# Altium project Exp_INDRA.PrjPcb
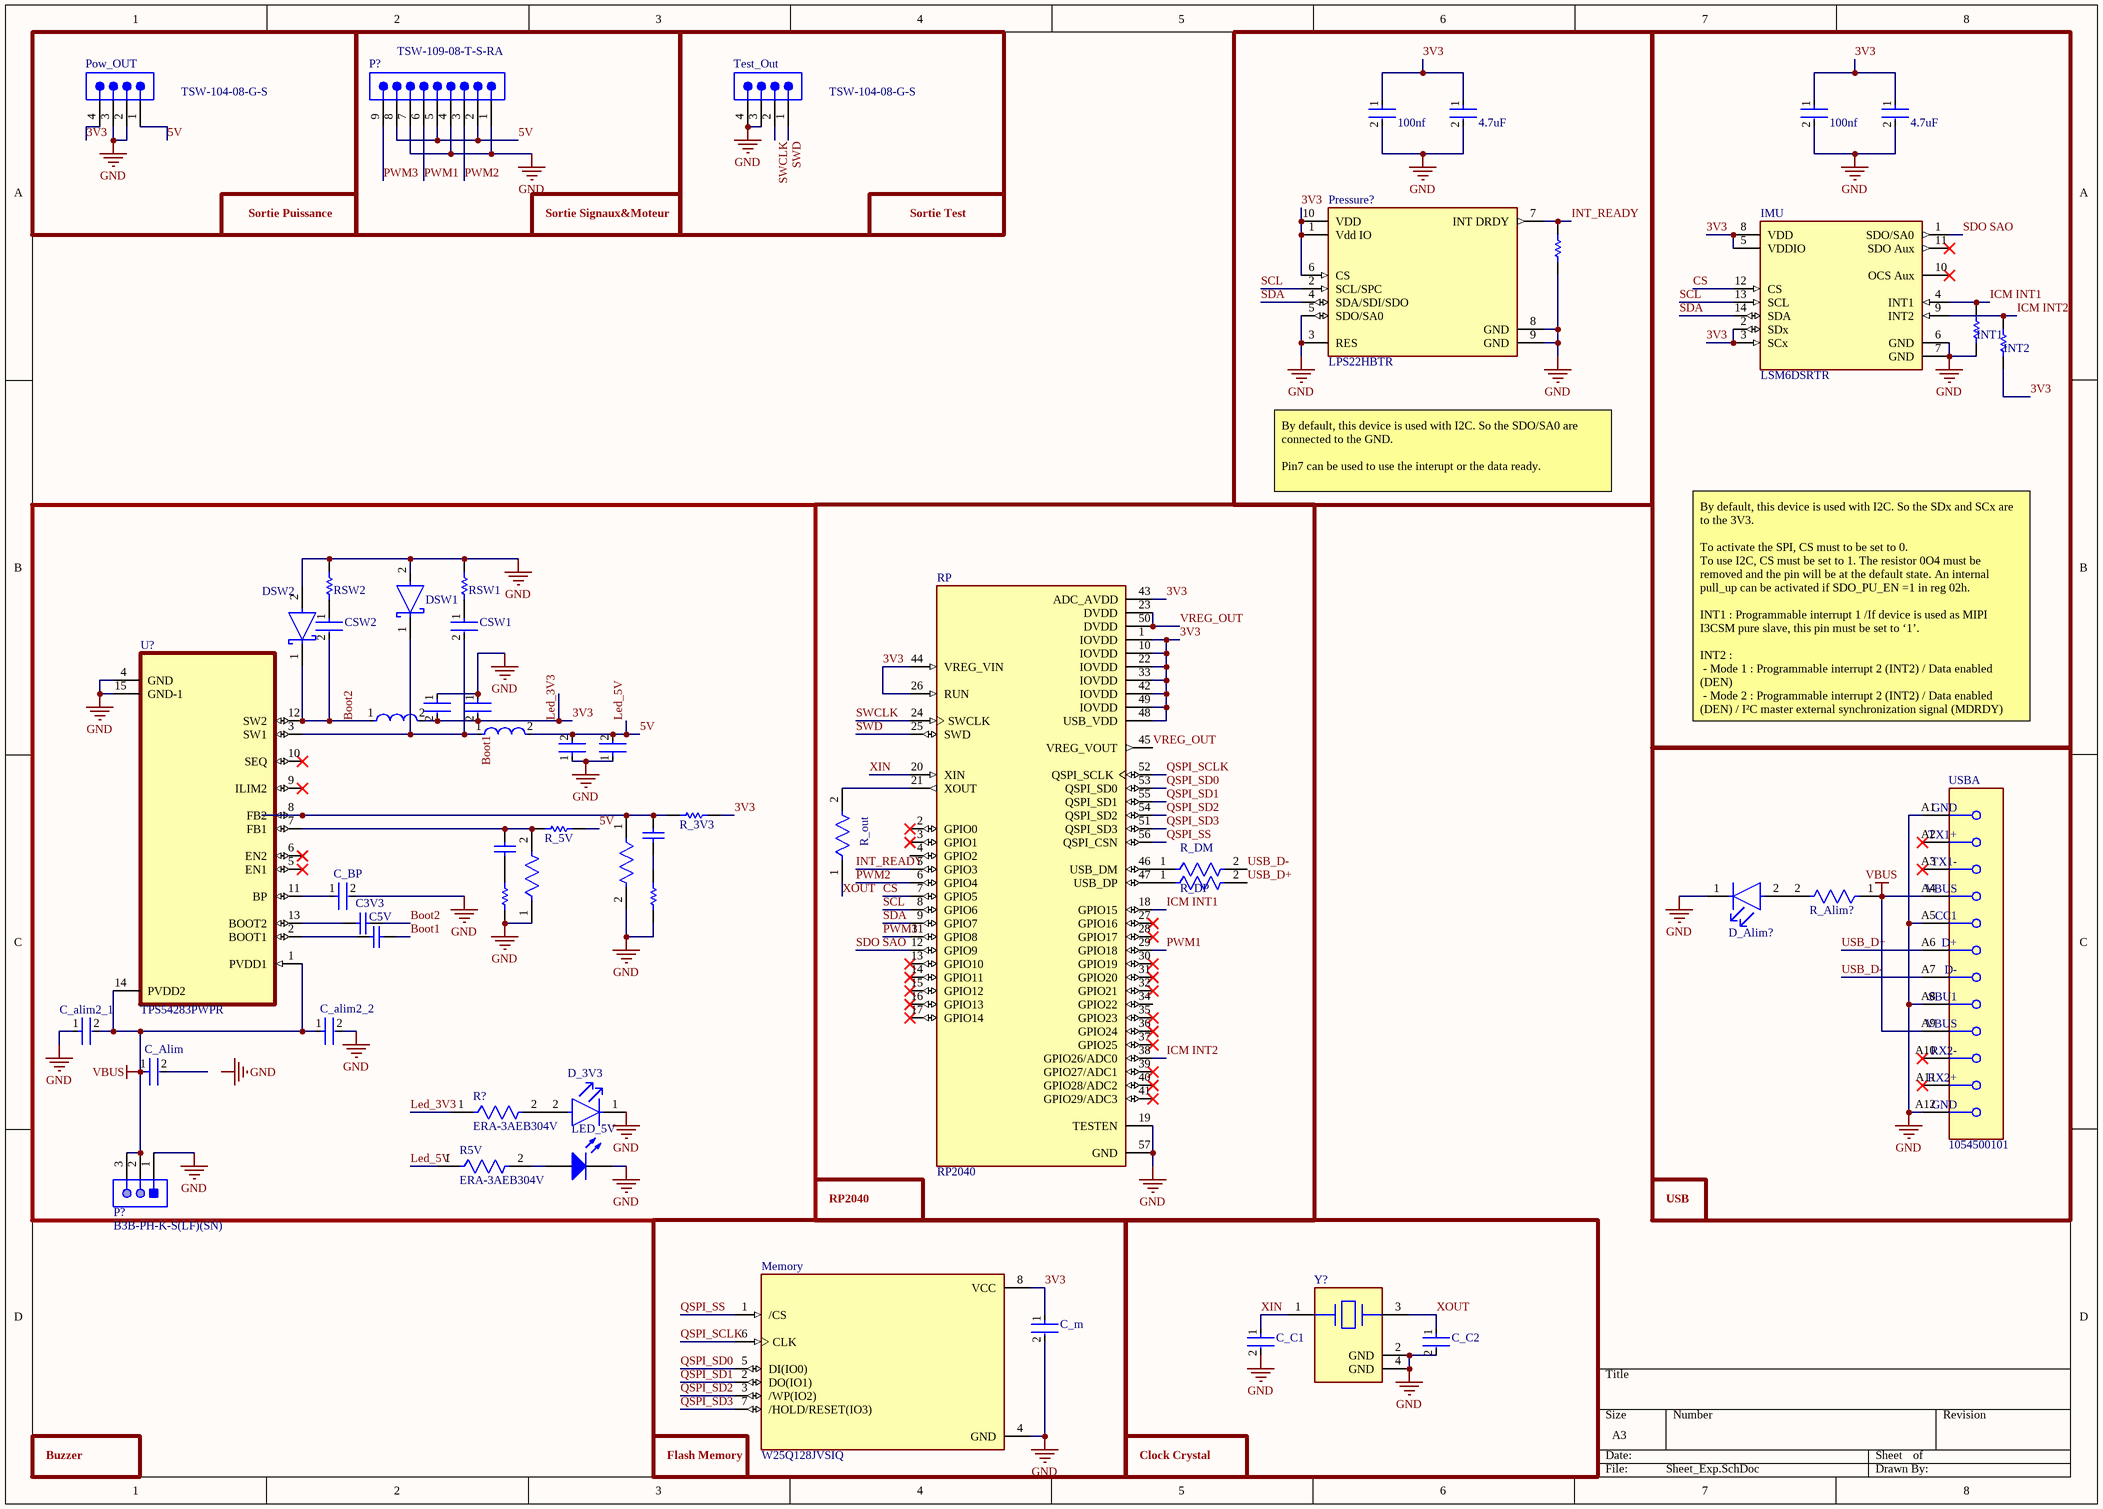
[diagram p0: Sheet_Exp.SchDoc]
1 sheet, 56 parts. Net scope: global (net labels, ports and power ports of the same name join across sheets).
Board file: PCB_Exp_INDRA.PcbDoc

## Sheet Sheet_Exp.SchDoc
size A3; SheetNumber: 1; SheetTotal: 1

### Parts
(Parts that share a designator on the sheet are numbered #1, #2 ... from top to bottom, then left to right.)
C3V3  GRM219R71H333KA01D  [CAPC2013X95X45NL10T25]  (value not drawn)
C5V  GRM219R71H333KA01D  [CAPC2013X95X45NL10T25]  (value not drawn)
C_3V31  GRM21BR61C106KE15L  [FP-GRM21B-0_1-IPC_C]  (value not drawn)
C_3V32  GRM21BR61C106KE15L  [FP-GRM21B-0_1-IPC_C]  (value not drawn)
C_5V1  GRM21BR61C106KE15L  [FP-GRM21B-0_1-IPC_C]  (value not drawn)
C_5V2  GRM21BR61C106KE15L  [FP-GRM21B-0_1-IPC_C]  (value not drawn)
C_Alim  GRM32ER60J107ME20L  [FP-GRM32-0_3-MFG]  (value not drawn)
C_alim2_1  GRM21BR61C106KE15L  [FP-GRM21B-0_1-IPC_C]  (value not drawn)
C_alim2_2  GRM21BR61C106KE15L  [FP-GRM21B-0_1-IPC_C]  (value not drawn)
C_BP  GRM155R60J475ME47D  [FP-GRM155-0_1-IPC_B]  (value not drawn)
C_C1  C0603C270J5GACTU  [FP-C0603C-CF-MFG]  (value not drawn)
C_C2  C0603C270J5GACTU  [FP-C0603C-CF-MFG]  (value not drawn)
C_m  CL10B104KB8NNND  [FP-CL10-IPC_A]  (value not drawn)
CFB2  GRM188R71H103KA01D  [CAPC1608X90X35ML10T15]  (value not drawn)
CFB?  GRM188R71H682KA01D  [CAPC1608X90X35LL10T15]  (value not drawn)
CIMU1  4.7uF  [FP-GRM188-0_2-IPC_C]
CIMU2  100nf  [FP-CGA3E-0_3-0_1-IPC_A]
CP1  4.7uF  [FP-GRM188-0_2-IPC_C]
CP2  100nf  [FP-CGA3E-0_3-0_1-IPC_A]
CSW1  C0603C471K5RACTU  [FP-C0603C-CF-MFG]  (value not drawn)
CSW2  C0603C471K5RACTU  [FP-C0603C-CF-MFG]  (value not drawn)
D_3V3  150060RS75000  [FP-150060RS75000-MFG]  (value not drawn)
D_Alim?  150060VS75000  [FP-150060VS75000-MFG]  (value not drawn)
DSW1  SK36B-TP  [FP-DO-214AA-MFG]  (value not drawn)
DSW2  SK36B-TP  [FP-DO-214AA-MFG]  (value not drawn)
IMU  LSM6DSRTR  [FP-LGA-14L-DM00249496-MFG]
INT1  ERJ3EKF1002V  [RESC1609X55X30LL15T15]  (value not drawn)
INT2  ERJ3EKF1002V  [RESC1609X55X30LL15T15]  (value not drawn)
L_3V3  LQH32CN220K23L  [FP-LQH32CH_23-MFG]  (value not drawn)
L_5V  LQH32CN220K23L  [FP-LQH32CH_23-MFG]  (value not drawn)
LED_5V  150060YS75000  [0603_A]  (value not drawn)
Memory  W25Q128JVSIQ  [SOIC127P790X216-8N]
P?#1  TSW-109-08-T-S-RA  [SMTC-TSW-109-08-X-S-RA]
P?#2  B3B-PH-K-S(LF)(SN)  [JST-B3B-PH-K-S-3_V]
Pow_OUT  TSW-104-08-G-S  [SMTC-TSW-104-08-X-S]
Pressure?  LPS22HBTR  [FP-HLGA-10L-8479831-0]
R1  ERJ-3EKF4701V  [RESC1608X55X30NL15T15]  (value not drawn)
R5V  ERA-3AEB304V  [FP-ERA3A-IPC_C]
R?  ERA-3AEB304V  [FP-ERA3A-IPC_C]
R_3V3  ERJ-3EKF2002V  [RESC1608X55X30ML15T15]  (value not drawn)
R_5V  ERJ-3EKF2002V  [RESC1608X55X30ML15T15]  (value not drawn)
R_Alim?  ERA-3AEB304V  [FP-ERA3A-IPC_C]  (value not drawn)
R_DM  ERJ-2RKF27R0X  [FP-ERJ2R-IPC_B]  (value not drawn)
R_DP  ERJ-2RKF27R0X  [FP-ERJ2R-IPC_B]  (value not drawn)
R_out  ERA-3AEB102V  [FP-ERA3A-IPC_C]  (value not drawn)
RFB2  CRCW06036K34FKEA  [FP-CRCW0603-e3-IPC_A]  (value not drawn)
RFB21  ERJ-3EKF4220V  [RESC1608X55X30LL15T15]  (value not drawn)
RFB22  CRCW06033K83FKEA  [FP-CRCW0603-e3-IPC_C]  (value not drawn)
RFB?  CRCW0603698RFKEA  [RESC1609X50X30NL10T20]  (value not drawn)
RP  RP2040  [QFN40P700X700X90-57N]
RSW1  ERJ3EKF1002V  [RESC1609X55X30LL15T15]  (value not drawn)
RSW2  ERJ3EKF1002V  [RESC1609X55X30LL15T15]  (value not drawn)
Test_Out  TSW-104-08-G-S  [SMTC-TSW-104-08-X-S]
U?  TPS54283PWPR  [IC_TPS27S100BPWPR]
USB  1054500101  [FP-1054500101-MFG]  (part A of 3)
Y?  ABM8G-12.000MHZ-18-D2Y-T  [FP-ABM8G-MFG]  (value not drawn)

### Blocks framed on the sheet
Sortie Puissance: Pow_OUT
Sortie Signaux&Moteur: P?#1
Sortie Test: Test_Out
RP2040: R_DM R_DP R_out RP
USB: D_Alim? R_Alim? USB
Clock Crystal: C_C1 C_C2 Y?

### Nets
GND: C_3V31.1 C_3V32.1 C_5V1.1 C_5V2.1 C_alim2_1.1 C_alim2_2.2 C_BP.2 C_C1.2 C_C2.2 C_m.2 CIMU1.2 CIMU2.2 CP1.2 CP2.2 D_3V3.1(C) D_Alim?.1(C) DSW1.2(A) DSW2.2(A) IMU.6(GND) IMU.7(GND) INT1.1 LED_5V.1(K) Memory.4(GND) P?#1.1 P?#1.4 P?#1.7 P?#2.1 Pow_OUT.2 Pow_OUT.3 Pressure?.3(RES) Pressure?.5(SDO/SA0) Pressure?.8(GND) Pressure?.9(GND) R1.1 RFB2.2 RFB21.1 RFB22.1 RFB?.2 RP.19(TESTEN) RP.57(GND) RSW1.1 RSW2.1 Test_Out.3 Test_Out.4 U?.4(GND) U?.15(GND-1) USB.A1(GND) USB.A5(CC1) USB.A8(SBU1) USB.A12(GND) Y?.2(GND) Y?.4(GND)
VBUS: C_Alim.1 C_alim2_1.2 C_alim2_2.1 P?#2.2 P?#2.3 R_Alim?.1 U?.1(PVDD1) U?.14(PVDD2) USB.A4(VBUS) USB.A9(VBUS)
3V3: C_3V31.2 C_3V32.2 C_m.1 CIMU1.1 CIMU2.1 CP1.1 CP2.1 IMU.2(SDx) IMU.3(SCx) IMU.5(VDDIO) IMU.8(VDD) INT2.1 L_3V3.2 Memory.8(VCC) Pow_OUT.4 Pressure?.1(Vdd_IO) Pressure?.6(CS) Pressure?.10(VDD) R?.1 R_3V3.1 RP.1(IOVDD) RP.10(IOVDD) RP.22(IOVDD) RP.26(RUN) RP.33(IOVDD) RP.42(IOVDD) RP.43(ADC_AVDD) RP.44(VREG_VIN) RP.48(USB_VDD) RP.49(IOVDD)  [also labelled Led_3V3]
5V: C_5V1.2 C_5V2.2 L_5V.2 P?#1.2 P?#1.5 P?#1.8 Pow_OUT.1 R5V.1 R_5V.2  [also labelled Led_5V]
Boot1: C5V.2 CSW1.2 DSW1.1(C) L_5V.1 U?.3(SW1)
Boot2: C3V3.2 CSW2.2 DSW2.1(C) L_3V3.1 U?.12(SW2)
CS: IMU.12(CS) RP.7(GPIO5)
ICM INT1: IMU.4(INT1) INT1.2 RP.18(GPIO15)
ICM INT2: IMU.9(INT2) INT2.2 RP.38(GPIO26/ADC0)
INT_READY: Pressure?.7(INT_DRDY) R1.2 RP.5(GPIO3)
PWM1: P?#1.6 RP.29(GPIO18)
PWM2: P?#1.3 RP.6(GPIO4)
PWM3: P?#1.9 RP.11(GPIO8)
QSPI_SCLK: Memory.6(CLK) RP.52(QSPI_SCLK)
QSPI_SD0: Memory.5(DI(IO0)) RP.53(QSPI_SD0)
QSPI_SD1: Memory.2(DO(IO1)) RP.55(QSPI_SD1)
QSPI_SD2: Memory.3(/WP(IO2)) RP.54(QSPI_SD2)
QSPI_SD3: Memory.7(/HOLD/RESET(IO3)) RP.51(QSPI_SD3)
QSPI_SS: Memory.1(/CS) RP.56(QSPI_CSN)
SCL: IMU.13(SCL) Pressure?.2(SCL/SPC) RP.8(GPIO6)
SDA: IMU.14(SDA) Pressure?.4(SDA/SDI/SDO) RP.9(GPIO7)
SDO SAO: IMU.1(SDO/SA0) RP.12(GPIO9)
SWCLK: RP.24(SWCLK) Test_Out.2
SWD: RP.25(SWD) Test_Out.1
USB_D+: R_DP.2 USB.A6(D+)
USB_D-: R_DM.2 USB.A7(D-)
VREG_OUT: RP.23(DVDD) RP.45(VREG_VOUT) RP.50(DVDD)
XIN: C_C1.1 RP.20(XIN) Y?.1
XOUT: C_C2.1 R_out.1 Y?.3
NetC3V3_1: C3V3.1 U?.13(BOOT2)
NetC5V_1: C5V.1 U?.2(BOOT1)
NetC_BP_1: C_BP.1 U?.11(BP)
NetCFB2_1: CFB2.1 R_5V.1 RFB22.2 U?.7(FB1)
NetCFB2_2: CFB2.2 RFB21.2
NetCFB?_1: CFB?.1 RFB?.1
NetCFB?_2: CFB?.2 R_3V3.2 RFB2.1 U?.8(FB2)
NetCSW1_1: CSW1.1 RSW1.2
NetCSW2_1: CSW2.1 RSW2.2
NetD_3V3_2: D_3V3.2(A) R?.2
NetD_Alim?_2: D_Alim?.2(A) R_Alim?.2
NetLED_5V_2: LED_5V.2(A) R5V.2
NetR_DM_1: R_DM.1 RP.46(USB_DM)
NetR_DP_1: R_DP.1 RP.47(USB_DP)
NetR_out_2: R_out.2 RP.21(XOUT)

Not connected (* = marked no-connect by the designer): C_Alim 2; IMU 10(OCS_Aux)* 11(SDO_Aux)*; RP 2(GPIO0)* 3(GPIO1)* 4(GPIO2) 13(GPIO10)* 14(GPIO11)* 15(GPIO12)* 16(GPIO13)* 17(GPIO14)* 27(GPIO16)* 28(GPIO17)* 30(GPIO19)* 31(GPIO20)* 32(GPIO21)* 34(GPIO22) 35(GPIO23)* 36(GPIO24)* 37(GPIO25)* 39(GPIO27/ADC1)* 40(GPIO28/ADC2)* 41(GPIO29/ADC3)*; U? 5(EN1)* 6(EN2)* 9(ILIM2)* 10(SEQ)*; USB A2(TX1+)* A3(TX1-)* A10(RX2-)* A11(RX2+)*

### Notes on the sheet
- By default, this device is used with I2C. So the SDO/SA0 are connected to the GND.
  Pin7 can be used to use the interupt or the data ready.
- By default, this device is used with I2C. So the SDx and SCx are to the 3V3.
  To activate the SPI, CS must to be set to 0.
  To use I2C, CS must be set to 1. The resistor 0O4 must be removed and the pin will be at the default state. An internal pull_up can be activated if SDO_PU_EN =1 in reg 02h.
  INT1 : Programmable interrupt 1 /If device is used as MIPI I3CSM pure slave, this pin must be set to ‘1’.
  INT2 :
  - Mode 1 : Programmable interrupt 2 (INT2) / Data enabled (DEN)
  - Mode 2 : Programmable interrupt 2 (INT2) / Data enabled (DEN) / I²C master external synchronization signal (MDRDY)
- Buzzer
- (near Memory) Flash Memory
- Labels drawn without touching a wire or pin: GND

### Library data of the parts
C3V3 C5V = CMP-1036-04169-2: Manufacturer: Murata; Part Number: GRM219R71H333KA01D
C_3V31 C_3V32 C_5V1 C_5V2 C_alim2_1 C_alim2_2 = CMP-2007-03453-2: Chip Multilayer Ceramic Capacitors for General Purpose, 0805, 10uF, X5R, 15%, 10%, 16V; Radiation Hardening: No; Thickness: 0.053inch; Voltage Rating (DC): 16V; Lead Free: Lead Free; Package Quantity: 1; Width: 1.25mm; Case Code (Imperial): 0805; Depth: 1.25mm; Packaging: Tape and Reel; Dielectric: X5R; Max Operating Temperature: 85°C; Tolerance: 10%; Voltage Rating: 16V; Voltage: 16V; Capacitance: 10uF; Height: 1.25mm; Case Code (Metric): 2012; Material: Ceramic; Mount: Surface Mount; Case/Package: 0805; REACH SVHC: No SVHC; Length: 2mm; Min Operating Temperature: -55°C; Termination: SMD/SMT
C_Alim = CMP-2000-05259-2: CAP CER 100UF 6.3V X5R 1210; 3DS Part Number: 220-00002; Manufacturer: Murata; Temperature Coefficient: 15%; Tolerance: 20%; Octopart: https://octopart.com/grm32er60j107me20l-murata-197007; ComponentLink2URL: https://search.murata.co.jp/Ceramy/image/img/A01X/G101/ENG/GRM32ER60J107ME20-01.pdf; Temperature Range High: +85°C; RoHS: TRUE; Device Class L3: Ceramic Capacitors; Manufacturer Part Number: GRM32ER60J107ME20L; Device Class L2: Capacitors; Voltage: 6.3V; Package: GRM32-0.3; Voltage Rating: 6.3V; Category: Cap; Device Class L1: Passive Components; Temperature Characteristic: X5R; Automotive: No; Digikey Description: CAP CER 100UF 6.3V X5R 1210; Temperature: -55°C to +85°C; Height: 2.7mm; Ipc Land Pattern Name: CAPC320250X250; Capacitance: 100uF; Material: Ceramic; Temperature Range Low: -55°C; Lead Free: Yes; Value: 100uF; ComponentLink2Description: Datasheet
C_BP = CMP-2008-04549-2: Chip Multilayer Ceramic Capacitors for General Purpose, 0402, 4.7uF, X5R, 15%, 20%, 6.3V; Height: 0.5mm; Weight: 0.000212oz; Length: 1mm; Case Code (Metric): 1005; Packaging: Tape and Reel; Termination: SMD/SMT; Dielectric: X5R; Depth: 0.5mm; Case Code (Imperial): 0402; Min Operating Temperature: -55°C; Case/Package: 0402; Voltage: 6.3V; Width: 0.02inch; Capacitance: 4.7uF; Lead Free: Lead Free; Thickness: 0.022inch; Contact Plating: Tin; REACH SVHC: No SVHC; Package Quantity: 10000; Tolerance: 20%; Voltage Rating (DC): 6.3V; Voltage Rating: 6.3V; Mount: Surface Mount; Max Operating Temperature: 85°C
C_C1 C_C2 = CMP-2006-03314-2: CAP CER 27PF 50V C0G/NP0 0603; Manufacturer: KEMET; Tolerance: 0.05; Automotive Grade: Grade 1; Temperature Characteristic: C0G; Temperature Coefficient: 30ppm/°C; RoHS: TRUE; Lead Free: Yes; Automotive: Yes; Material: Ceramic; Category: Cap; Digikey Description: CAP CER 27PF 50V C0G/NP0 0603; Device Class L3: Ceramic Capacitors; Capacitance: 27 pF; Temperature Range High: +125°C; Octopart: https://octopart.com/c0603c270j5gactu-kemet-136059; Value: 27 pF; Temperature Range Low: -55°C; ComponentLink2URL: https://api.kemet.com/component-edge/download/datasheet/C0603C100J5GACAUTO.pdf; Device Class L2: Capacitors; Mouser Description: Multilayer Ceramic Capacitors MLCC - SMD/SMT 50volts 27pF C0G 5%; Device Class L1: Passive Components; ComponentLink2Description: Datasheet; Voltage Rating: 50 V; Package: C0603C-CF; Height: 0.87mm; Temperature: -55°C to +125°C; Manufacturer Part Number: C0603C270J5GACTU
C_m = CMP-13271-000587-1: Cap Ceramic 100nF 50V X7R ±10% Pad SMD 0603 +125°C T/R; Case/Package: 0603; Depth: 0.8mm; Max Operating Temperature: 125°C; Lead Free: Lead Free; Material: Ceramic; Voltage Rating: 50V; Min Operating Temperature: -55°C; Voltage Rating (DC): 50V; Dielectric: X7R; Height: 0.8mm; Capacitance: 100nF; Thickness: 0.035inch; Radiation Hardening: No; Voltage: 50V; Packaging: Tape and Reel; Length: 1.6mm; Tolerance: 10%; Width: 0.031inch; Mount: Surface Mount; Package Quantity: 10000
CFB2 = CMP-2100-03642-1: Chip Capacitor, 10 nF, +/- 10%, 50 V, -55 to 125 degC, 0603 (1608 Metric), RoHS, Tape and Reel; Manufacturer: Murata; Insulation Resistance: 10GR; Dielectric: X7R; Voltage Rating: 50V; Capacitance: 10nF; Dielectric Material: Ceramic; Package Quantity: 1; Lead Free: LeadFree; Case/Package: 0603; Termination: SMD/SMT; REACH SVHC: Unknown; Manufacturer URL: http://www.murata.com/; Datasheet URL: http://search.murata.co.jp/Ceramy/image/img/A01X/G101/ENG/GRM188R71H103KA01-01.pdf; Mount: SurfaceMount; Datasheet Version: 42401.0; Number of Pins: 2; Length: 1.6mm; Voltage: 50V; Depth: 0.8mm; Tolerance: 10%; Min Operating Temperature: -55degC; Voltage Rating (DC): 50V; Max Operating Temperature: 125degC; Package Description: 2-Pin Surface Mount Device, Body 1.6 x 0.8 mm; RoHSCompliant: True; Case Code (Imperial): 0603; Width: 0.031inch; Case Code (Metric): 1608; Height: 0.8mm; Package Reference: 0603; Packaging: TapeandReel; Thickness: 0.035inch; Material: Ceramic
CFB? = CMP-2006-02934-1: Manufacturer: Murata; Part Number: GRM188R71H682KA01D
CIMU1 CP1 = CMP-2006-02545-2: Chip Multilayer Ceramic Capacitors for General Purpose, 0603, 4.7uF, X5R, 15%, 10%, 35V GRM188R6YA475KE15D; Lead Free: Lead Free; Max Operating Temperature: 85°C; Case Code (Imperial): 0603; Capacitance: 4.7uF; Width: 0.8mm; Thickness: 0.031inch; Case Code (Metric): 1608; Min Operating Temperature: -55°C; Voltage Rating (DC): 35V; Dielectric: X5R; Voltage: 35V; Packaging: Tape and Reel; Resistor Type: Ceramic; Weight: 0.000222oz; Mount: Surface Mount; Material: Ceramic; Depth: 0.8mm; Tolerance: 10%; REACH SVHC: No SVHC; Case/Package: 0603; Voltage Rating: 35V; Package Quantity: 4000; Height: 0.8mm; Length: 1.6mm; Termination: SMD/SMT
CIMU2 CP2 = CMP-2000-07546-2: Cap Ceramic 100nF 50V X7R 10% Pad SMD 0603 +125°C Automotive T/R CGA3E2X7R1H104K080AA; Weight: 7.1E-05oz; Composition: Ceramic; Max Operating Temperature: 125°C; Termination: SMD/SMT; Dielectric: X7R; Length: 1.6mm; Package Quantity: 1; REACH SVHC: No SVHC; Lead Free: Lead Free; Case Code (Metric): 1608; Min Operating Temperature: -55°C; Packaging: Tape and Reel; Tolerance: 10%; Voltage Rating: 50V; Case Code (Imperial): 0603; Capacitance: 100nF; Case/Package: 0603; Voltage Rating (DC): 50V; Depth: 0.8mm; Radiation Hardening: No; Ratings: AEC-Q200; Mount: Surface Mount; Voltage: 50V; Thickness: 0.035inch; Width: 0.8mm; Height: 0.8mm
CSW1 CSW2 = CMP-2006-03816-2: CAP CER 470PF 50V X7R 0603; Manufacturer: KEMET; Tolerance: 0.1; Temperature Coefficient: 30ppm/°C; Automotive Grade: Grade 1; Capacitance: 470 pF; Manufacturer Part Number: C0603C471K5RACTU; Temperature Characteristic: X7R; Mouser Description: Ceramic Capacitor, 470Pf, 50V, X7R, 10%, 0603, Full Reel; Material: Ceramic; Height: 0.87mm; Temperature: -55°C to +125°C; RoHS: TRUE; Lead Free: Yes; Category: Cap; ComponentLink2URL: https://api.kemet.com/component-edge/download/datasheet/C0603C100J5GACAUTO.pdf; Device Class L3: Ceramic Capacitors; Temperature Range High: +125°C; Package: C0603C-CF; Automotive: Yes; Device Class L2: Capacitors; Device Class L1: Passive Components; Value: 470 pF; Digikey Description: CAP CER 470PF 50V X7R 0603; Temperature Range Low: -55°C; ComponentLink2Description: Datasheet; Voltage Rating: 50 V; Octopart: https://octopart.com/c0603c471k5ractu-kemet-89311
D_3V3 = CMP-1426-00001-2: LED RED CLEAR 0603 SMD; Luminous Intensity: 250mcd; Viewing Angle: 140°; Dominant Wavelength: 625nm; Test Current: 20mA; Forward Current: 30mA; Forward Voltage: 2V; Lens Color: Colorless; Lens Size: 0.7mm; Width: 0.8mm; Series: WL-SMCW; Color: Red; Min Operating Temperature: -40°C; RoHS Compliant: Yes; Height: 0.8mm; Package Quantity: 1; Packaging: Cut Tape; Mount: Surface Mount; Case/Package: 0603; Lens Transparency: Clear; Length: 1.6mm; Case Code (Imperial): 0603; Lens Style: Clear; Wavelength: 625nm; Max Operating Temperature: 85°C; Case Code (Metric): 1608
D_Alim? = CMP-1426-00006-5: LED GREEN CLEAR 0603 SMD; Viewing Angle: 140°; Reverse Voltage (DC): 5V; Forward Voltage: 2V; Power Rating: 72mW; Lens Size: 0.7mm; Test Current: 20mA; Lens Color: Colorless; Lens Style: Rectangular; Luminous Intensity: 40mcd; Wavelength: 570nm; Length: 1.6mm; Max Operating Temperature: 85°C; Lens Transparency: Clear; Width: 0.8mm; Mount: Surface Mount; Weight: 0.000882oz; Package Quantity: 4000; Packaging: Cut Tape; RoHS Compliant: Yes; Case/Package: 0603; Series: WL-SMCW; Case Code (Metric): 1608; Illumination Color: Green; Color: Green; Case Code (Imperial): 0603; Forward Current: 20mA; Min Operating Temperature: -40°C; Height: 0.8mm; Dominant Wavelength: 570nm; Number of Pins: 2
DSW1 DSW2 = CMP-56206-000011-1: DIODE SCHOTTKY 60V 3A DO214AA; Max Surge Current: 100A; Capacitance: 45pF; Max Reverse Current: 20mA; Forward Voltage: 750mV; Max Reverse Leakage Current: 500uA; Polarity: Standard; Element Configuration: Single; Max Repetitive Reverse Voltage (Vrrm): 60V; Current Rating: 3A; Length: 4.57mm; Radiation Hardening: No; Package Quantity: 1; Forward Current: 3A; Voltage Rating (DC): 60V; Case/Package: DO-214AA; Min Operating Temperature: -55°C; Number of Pins: 2; Mount: Surface Mount; Max Forward Surge Current (Ifsm): 100A; RoHS Compliant: Yes; Packaging: Tape and Reel; Max Reverse Voltage (DC): 60V; Max Operating Temperature: 125°C; Width: 3.94mm; Height: 2.44mm; Peak Non-Repetitive Surge Current: 100A; Output Current: 3A; Lead Free: Lead Free; Average Rectified Current: 3A
IMU = CMP-12177-000003-1: INEMO INERTIAL MODULE: 3D ACCELE; Manufacturer: STMicroelectronics; Sensor Output: I2C,SPI; Accel Range: 2/4/8/16g; Gyro Range: 125/250/500/1000/2000/4000°/s; Operating Supply Current: 360-1200uA; Max Supply Voltage: 3.6V; Min Supply Voltage: 1.62V; Sensor Type: Temperature,Accelerometer,Gyroscope; Device Class L3: Inertial Measurement Units (IMUs); Package: LGA-14L-DM00249496; ComponentLink2Description: Datasheet; Mouser Description: In a Pack of 2, LSM6DSRTR STMicroelectronics, 3-Axis Accelerometer, Gyroscope, 14-Pin LGA; Footprint Url: https://www.st.com/content/ccc/resource/technical/document/technical_note/73/17/9c/16/dd/96/4a/01/CD00134799.pdf/files/CD00134799.pdf/jcr:content/translations/en.CD00134799.pdf; RoHS: TRUE; Automotive: No; Temperature Range High: +85°C; Digikey Description: INEMO INERTIAL MODULE: 3D ACCELE; Manufacturer Part Number: LSM6DSRTR; ComponentLink2URL: https://www.st.com/resource/en/datasheet/lsm6dsr.pdf; Lead Free: Yes; Category: IC; Temperature Range Low: -40°C; Height: 0.86mm; Octopart: https://octopart.com/lsm6dsrtr-stmicroelectronics-93180177; Temperature: -40°C to +85°C; Device Class L1: Sensors; Device Class L2: Motion Sensors
INT1 INT2 RSW1 RSW2 = CMP-1012-00623-3: Chip Resistor, 10 KOhm, +/- 1%, 0.1 W, -55 to 155 degC, 0603 (1608 Metric), RoHS, Tape and Reel; Manufacturer: Panasonic; Voltage Rating: 75V; Case\/Package: 0603; Power Rating: 100mW; Resistance: 10KOhm; Temperature Coefficient: 100ppm\/degreesC; Number of Pins: 2; Package Reference: 603; Depth: 0.8mm; Mount: SurfaceMount; Package Description: 2-Pin Surface Mount Device, Body 1.6 x 0.85 mm; Datasheet Version: 02/2017; Length: 1.6mm; Lead Free: LeadFree; Height: 0.45mm; Number of Terminations: 2; Max Power Dissipation: 100mW; Min Operating Temperature: -55degC; Datasheet URL: https://industrial.panasonic.com/cdbs/www-data/pdf/RDA0000/AOA0000C304.pdf; Termination: SMD/SMT; Case Code (Metric): 1608; Case Code (Imperial): 0603; Tolerance: 1%; Max Operating Temperature: 155degC; RoHSCompliant: true; Voltage Rating (DC): 75V; Radiation Hardening: No; Packaging: TapeandReel; Composition: ThickFilm; Mounting Technology: SurfaceMount; Manufacturer URL: http://www.panasonic.com/; Width: 0.031inch; REACH SVHC: NoSVHC; Contact Plating: Tin; Military Standard: Not; Package Quantity: 1
L_3V3 L_5V = CMP-06042-007714-2: Wire Wound Ferrite Inductor for Power Lines 22μH ±10% 0.923Ω 250mA 1210; Self Resonant Frequency: 19MHz; Test Frequency: 1MHz; DC Resistance (DCR): 710mR; Inductance: 22uH; Current: 80mA; Shielding: Unshielded; Rated Current-Max: 250mA; Tolerance: 10%; Case Code (Metric): 3225; Max DC Current: 250mA; Length: 3.2mm; Core Material: Ferrite; Max Operating Temperature: 85°C; RoHS Compliant: Yes; Radiation Hardening: No; Min Operating Temperature: -40°C; Lead Free: Lead Free; Weight: 0.002116oz; Termination: SMD/SMT; Width: 2.5mm; Military Standard: Not; Depth: 2.7mm; Frequency: 19MHz; Height: 2mm; Package Quantity: 2000; Case/Package: 1210; Current Rating: 250mA; Case Code (Imperial): 1210; Packaging: Tape and Reel; DC Current: 250mA; Series: LQH32C_23; Mount: Surface Mount
LED_5V = CMP-1426-00005-1: SMD mono-color Chip LED, WL-SMCW, Yellow; Manufacturer: Wuerth Elektronik; ComponentLink1URL: http://www.we-online.com; PartNumber: 150060YS75000; Color: Yellow; ComponentLink2Description: Datasheet; ComponentLink2URL: http://katalog.we-online.com/led/datasheet/150060YS75000.pdf; ComponentLink1Description: Manufacturer URL; PackageReference: 0603_A
Memory = W25Q128JVSIQ: FLASH - NOR Memory IC 128Mb (16M x 8) SPI - Quad I/O, QPI, DTR 133 MHz 8-SOIC; MF: Winbond Electronics; Price: None; Purchase-URL: https://pricing.snapeda.com/search/part/W25Q128JVSIQ/?ref=eda; Check_prices: https://www.snapeda.com/parts/W25Q128JVSIQ/Winbond+Electronics/view-part/?ref=eda; Value: *; MP: W25Q128JVSIQ; Package: SOIC-8 Winbond; SnapEDA_Link: https://www.snapeda.com/parts/W25Q128JVSIQ/Winbond+Electronics/view-part/?ref=snap; Availability: In Stock
P?#1 = CMP-1024-00420-1: 0.025" SQ Post Header, Through-hole, Right Angle, -55 to 105 degC, 2.54 mm Pitch, 9-Pin, Male, RoHS; Manufacturer: Samtec; Pitch: 2.54 mm; Mounting Technology: Through-hole; ComponentLink3URL: http://www.samtec.com/documents/webfiles/cpdf/TSW-XXX-XX-XXX-X-XX-XXX-MKT.pdf; ComponentLink1URL: http://www.samtec.com; PackageDescription: .025[0.64] SQ. Post Terminal Strip Assembly; ComponentLink2Description: Datasheet; PartNumber: TSW-109-08-T-S-RA; DatasheetVersion: F-214; Temperature Range: -55 to 105 degC; ComponentLink3Description: Package Specification; PackageReference: TSW-109-08-X-S-RA; PackageVersion: DM, 8/1988; ComponentLink2URL: http://www.samtec.com/documents/webfiles/pdf/TSW_TH.PDF; RoHS: True; Orientation: Right Angle; ComponentLink1Description: Manufacturer URL
P?#2 = CMP-2000-05164-1: Male Header, Pitch 2 mm, 1 x 3 Position, Height 6 mm, Tail Length 3.4 mm, -25 to 85 degC, RoHS, Bulk; Manufacturer: JST; Style/Orientation: StraightHeader/Plug; Pitch: 2mm; No of Positions: 3; Termination: Crimp; Manufacturer URL: http://www.jst.com/home2.html; Datasheet Version: Oct-06; Type: ShroudedHeader; Datasheet URL: https://datasheet.ciiva.com/11746/0900766b80826550-11746939.pdf
Pow_OUT Test_Out = CMP-1024-00357-1: 0.025" SQ Post Header, Through-hole, Vertical, -55 to 125 degC, 2.54 mm Pitch, 4-Pin, Male, RoHS; Manufacturer: Samtec; Pitch: 2.54 mm; RoHS: True; ComponentLink3URL: http://www.samtec.com/documents/webfiles/cpdf/TSW-XXX-XX-XXX-X-XX-XXX-MKT.pdf; Mounting Technology: Through-hole; ComponentLink2URL: http://www.samtec.com/documents/webfiles/pdf/TSW_TH.PDF; ComponentLink1URL: http://www.samtec.com; ComponentLink3Description: Package Specification; PackageVersion: DM, 8/1988; ComponentLink2Description: Datasheet; PackageReference: TSW-104-08-X-S; PackageDescription: .025[0.64] SQ. Post Terminal Strip Assembly; PartNumber: TSW-104-08-G-S; ComponentLink1Description: Manufacturer URL; Temperature Range: -55 to 125 degC; DatasheetVersion: F-214; Orientation: Vertical
Pressure? = CMP-12182-000004-1: MEMS NANO PRESSURE SENSOR: 260-1; Manufacturer: STMicroelectronics; Sensor Output: I2C,SPI; Port Style: No Port; Max Supply Voltage: 3.6V; Operating Supply Current: 3-12uA; Min Supply Voltage: 1.7V; Device Class L3: unset; Device Class L1: Sensors; Manufacturer Part Number: LPS22HBTR; Temperature Range High: +85°C; Digikey Description: MEMS NANO PRESSURE SENSOR: 260-1; Device Class L2: Pressure Sensors; RoHS: TRUE; Lead Free: Yes; Height: 0.8mm; Automotive: No; Octopart: https://octopart.com/lps22hbtr-stmicroelectronics-51851131; Package: HLGA-10L-8479831; Temperature Range Low: -40°C; Category: IC; Temperature: -40°C to +85°C; ComponentLink2Description: Datasheet; ComponentLink2URL: https://www.st.com/resource/en/datasheet/lps22hb.pdf; Footprint Url: https://www.st.com/content/ccc/resource/technical/document/technical_note/73/17/9c/16/dd/96/4a/01/CD00134799.pdf/files/CD00134799.pdf/jcr:content/translations/en.CD00134799.pdf
R1 = CMP-1012-00586-3: Precision Thick Film Chip Resistor, 4.7 KOhm, +/- 1%, -55 to 155 degC, 0603 (1608 Metric), RoHS, Tape and Reel; Resistance: 220 Ohm; Voltage Rating: 50 V; Elements: 4; Case\Package: 1205; Tolerance: 5%; Power Rating: 250 mW; PackageReference: 0603; Max Operating Temperature: 125 degC; REACH SVHC: No SVHC; Width: 0.063 inch; Length: 0.126 inch; Height: 0.024 inch; Mount: Surface Mount; Package Quantity: 1; DatasheetVersion: Apr-15; ComponentLink1Description: Manufacturer URL; Min Operating Temperature: -55 degC; Packaging: Tape and Reel; Radiation Hardening: No; ComponentLink2URL: http://industrial.panasonic.com/cdbs/www-data/pdf/RDA0000/AOA0000C86.pdf; Case Code (Metric): 3216; Pins: 8; Case Code (Imperial): 1206; Type (Resistor): Thick Film; RoHSCompliant: true; ComponentLink2Description: Datasheet; PackageDescription: 2-Pin Surface Mount Device, Body 1.6 x 0.85 mm; ComponentLink1URL: http://www.panasonic.com/
R5V R? R_Alim? = CMP-2000-00028-2: RES SMD 300K OHM 0.1% 1/10W 0603; Voltage Rating (DC): 75V; Temperature Coefficient: 25ppm/°C; Resistance: 300kR; Power Rating: 100mW; Technology: THIN FILM; Case/Package: 0603; Width: 0.8mm; Contact Plating: Tin; Case Code (Imperial): 0603; Series: ERA; Construction: Rectangular; Depth: 0.8mm; Resistance Tolerance: 0.1%; Height: 0.45mm; Voltage Rating: 75V; Tolerance: 0.1%; Resistor Type: Thin Film; Max Operating Temperature: 155°C; Length: 1.6mm; Weight: 7.1E-05oz; REACH SVHC: No SVHC; Min Operating Temperature: -55°C; RoHS Compliant: Yes; Radiation Hardening: No; Mount: Surface Mount; Number of Terminations: 2; Size Code: 0603; Packaging: Tape and Reel; Case Code (Metric): 1608; Package Quantity: 5000; Military Standard: Not; Max Power Dissipation: 100mW; Lead Free: Lead Free; Number of Pins: 2; Termination: SMD/SMT
R_3V3 R_5V = CMP-2000-00318-1: Manufacturer: Panasonic; Part Number: ERJ-3EKF2002V
R_DM R_DP = CMP-2002-00830-2: RES SMD 27 OHM 1% 1/10W 0402; Voltage Rating: 50V; Temperature Coefficient: 100ppm/°C; Resistance: 27R; Power Rating: 100mW; Military Standard: Not; Construction: Rectangular; Tolerance: 1%; Features: Automotive AEC-Q200; Length: 1mm; Lead Free: Lead Free; Mount: Surface Mount; Number of Terminations: 2; Radiation Hardening: No; Number of Pins: 2; Width: 0.5mm; Contact Plating: Tin; Voltage Rating (DC): 50V; Resistance Tolerance: 1%; Series: ERJ; Packaging: Tape and Reel; Case/Package: 0402; Technology: THICK FILM; REACH SVHC: No SVHC; Depth: 0.5mm; Resistor Type: Thick Film; Package Quantity: 1; Termination: SMD/SMT; Case Code (Imperial): 0402; Height: 0.35mm; Weight: 2.8E-05oz; Max Operating Temperature: 155°C; Case Code (Metric): 1005; Min Operating Temperature: -55°C; RoHS Compliant: Yes; Max Power Dissipation: 100mW
R_out = CMP-2000-00873-2: RES SMD 1K OHM 0.1% 1/10W 0603; Temperature Coefficient: 25ppm/°C; Voltage Rating: 75V; Max Power Dissipation: 100mW; Resistance: 1kR; Technology: METAL FILM; Number of Pins: 2; Packaging: Tape and Reel; Case Code (Imperial): 0603; Case Code (Metric): 1608; Min Operating Temperature: -55°C; REACH SVHC: No SVHC; Length: 1.6mm; Termination: SMD/SMT; Depth: 0.8mm; Resistance Tolerance: 0.1%; Number of Terminations: 2; Width: 0.8mm; Military Standard: Not; Tolerance: 0.1%; Package Quantity: 5000; Contact Plating: Tin; Height: 0.45mm; Construction: Rectangular; Case/Package: 0603; Max Operating Temperature: 155°C; Resistor Type: Thin Film; Series: ERA-3A; Size Code: 0603; RoHS Compliant: Yes; Mount: Surface Mount; Radiation Hardening: No; Power Rating: 100mW
RFB2 = CMP-2000-03547-2: RES Thick Film, 6.34kΩ, 1%, 0.1W, 100ppm/°C, 0603; Resistance: 6.34kR; Max Power Dissipation: 100mW; Voltage Rating: 75V; Min Operating Temperature: -55°C; Width: 0.033inch; Case/Package: 0603; Contact Plating: Tin; Package Quantity: 10; Radiation Hardening: No; Number of Pins: 2; Depth: 0.85mm; Max Operating Temperature: 155°C; Temperature Coefficient: 100ppm/°C; Termination: SMD/SMT; Height: 0.45mm; Length: 1.55mm; Packaging: Tape and Reel; Case Code (Metric): 1608; Weight: 7.1E-05oz; Composition: Thick Film; Case Code (Imperial): 0603; Military Standard: Not; Number of Terminations: 2; Tolerance: 1%; Power Rating: 100mW; Features: Automotive AEC-Q200
RFB21 = CMP-2000-00493-1: Manufacturer: Panasonic; Part Number: ERJ-3EKF4220V
RFB22 = CMP-2000-03310-2: RES Thick Film, 3.83kΩ, 1%, 0.1W, 100ppm/°C, 0603; Resistance: 3.83kR; Max Power Dissipation: 100mW; Voltage Rating (DC): 75V; Case Code (Metric): 1608; Depth: 0.85mm; Military Standard: Not; Length: 1.55mm; Width: 0.85mm; Radiation Hardening: No; Case/Package: 0603; Temperature Coefficient: 100ppm/°C; Tolerance: 1%; Contact Plating: Tin; Max Operating Temperature: 155°C; Power Rating: 100mW; Termination: SMD/SMT; Features: Automotive AEC-Q200; Min Operating Temperature: -55°C; Packaging: Tape and Reel; Number of Pins: 2; Number of Terminations: 2; Package Quantity: 10; Height: 0.45mm; Voltage Rating: 75V; Weight: 7.1E-05oz; Composition: Thick Film; Lead Free: Lead Free; Case Code (Imperial): 0603
RFB? = CMP-1012-00493-2: Manufacturer: Vishay Dale; Part Number: CRCW0603698RFKEA
RP = RP2040: RP2040 chip for Raspberry Pi Pico - ARMÂ® CortexÂ®-M0+ MCU 32-Bit; Check_prices: https://www.snapeda.com/parts/RP2040/Raspberry+Pi/view-part/?ref=eda; Value: *; Availability: In Stock; MP: RP2040; Price: None; Package: None; SnapEDA_Link: https://www.snapeda.com/parts/RP2040/Raspberry+Pi/view-part/?ref=snap; Purchase-URL: https://pricing.snapeda.com/search/part/RP2040/?ref=eda; MF: Raspberry Pi
USB = CMP-04767-000004-1: CONN RCP USB3.1 TYPEC 24P SMD RA; Manufacturer: Molex; Number Of Contacts: 24; Voltage Rating: 30V; Shielding: true; Is Female: yes; Current Rating: 0.25/1.25/5A; Pitch: 0.5mm; Conn Orientation: Right Angle; Package: 0; Height: 3.44mm; Footprint Url: https://www.molex.com/pdm_docs/sd/1054500101_sd.pdf; Device Class L1: Connectors; Category: Conn; Device Class L2: USB Connectors; Digikey Description: CONN RCP USB3.1 TYPEC 24P SMD RA; Contact Material: Gold,Nickel; Mouser Description: USB Shielded I/O Receptacle; Type C; Right Angle; Surface Mount; Gold over Nickel; ComponentLink2Description: Datasheet; Lead Free: Yes; Automotive: No; Temperature Range High: +85°C; RoHS: TRUE; Octopart: https://octopart.com/105450-0101-molex-68082325; ComponentLink2URL: https://www.molex.com/webdocs/datasheets/pdf/en-us/1054500101_IO_CONNECTORS.pdf; Temperature: -30°C to +85°C; Usb Standard: USB 3.1; Temperature Range Low: -30°C; Device Class L3: unset; Manufacturer Part Number: 1054500101
Y? = CMP-2000-05039-3: Crystal 12MHz ±20ppm (Tol) ±30ppm (Stability) 18pF FUND 120Ω 4-Pin SMD T/R; Series Resistance: 120R; Max Operating Temperature: 85°C; Mount: Surface Mount; Width: 2.5mm; Series: ABM8G; Termination: SMD/SMT; Frequency Tolerance: 20ppm; Tolerance: 20ppm; Min Operating Temperature: -40°C; Operating Frequency: 12 MHz; Depth: 2.5mm; Load Capacitance: 18pF; Number of Pins: 4; Length: 3.2mm; Radiation Hardening: No; Frequency Stability: 30ppm; Height: 1mm; Packaging: Tape and Reel; Package Quantity: 1000; ESR (Equivalent Series Resistance): 120R; Lead Free: Lead Free; Frequency: 12MHz; Case/Package: CSMD
U? = TPS54283PWPR: Package: None; Price: None; Value: *; MP: TPS54283PWPR; Availability: Unavailable